# EAGLE design Module_Motor_Stepper (EAGLE 9.6.2)
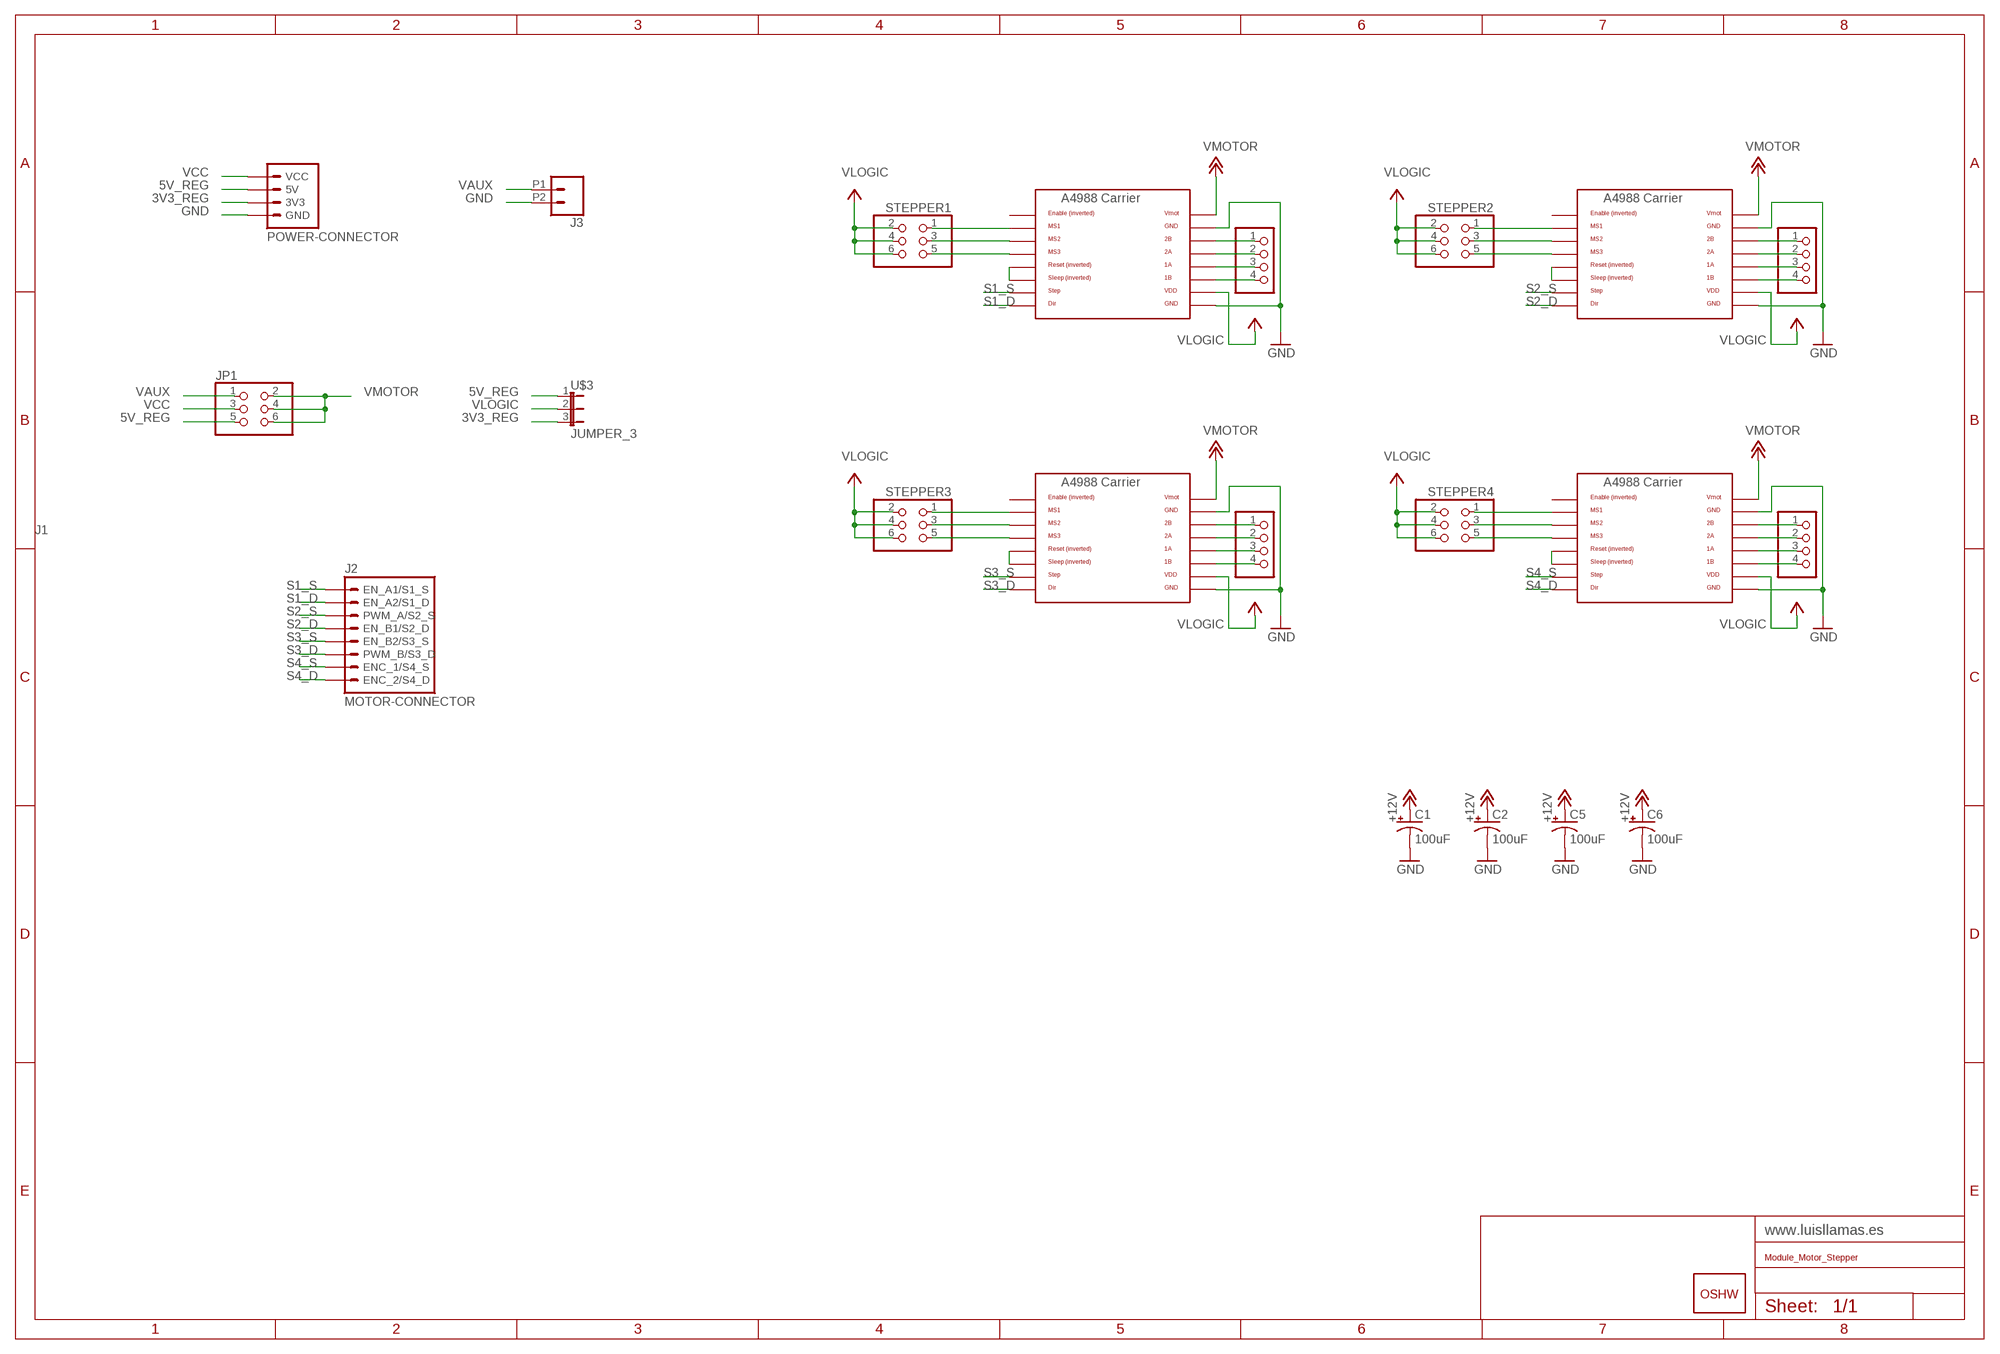
[diagram p0: schematic, sheet 1]

## Parts
C1  100uF  CPOL-US153CLV-0605  [153CLV-0605]
C2  100uF  CPOL-US153CLV-0605  [153CLV-0605]
C5  100uF  CPOL-US153CLV-0605  [153CLV-0605]
C6  100uF  CPOL-US153CLV-0605  [153CLV-0605]
E0-MOT1  PINHD-1X4  [1X04]
E0-MOT2  PINHD-1X4  [1X04]
E0-MOT4  PINHD-1X4  [1X04]
E0-MOT6  PINHD-1X4  [1X04]
GOLD_ORB_SM1  OSHWLOGO_GOLD_ORB_MED  [OSHW1]
J1  POWER-CONNECTOR  [POWER-CONNECTOR]
J2  MOTOR-CONNECTOR  [MOTOR-CONNECTOR]
J3  CONN_022.54MM_SCREWTERM  [1X02_2.54_SCREWTERM]
JP1  JUMPER_3X2/OCT  [JUMPER_3X2]
STEPPER1  PINHD-2X3  [2X03]
STEPPER2  PINHD-2X3  [2X03]
STEPPER3  PINHD-2X3  [2X03]
STEPPER4  PINHD-2X3  [2X03]
U$1  A4988BREAKOUT  [A4988BREAKOUT]
U$2  A4988BREAKOUT  [A4988BREAKOUT]
U$3  JUMPER_3  [JUMPER_3]
U$5  A4988BREAKOUT  [A4988BREAKOUT]
U$7  A4988BREAKOUT  [A4988BREAKOUT]

## Nets
3V3_REG: J1.3V3 U$3.3
5V_REG: J1.5V JP1.5 U$3.1
GND: C1.- C2.- C5.- C6.- J1.GND J3.P2 U$1.GND U$1.GND@0(GND) U$2.GND U$2.GND@0(GND) U$5.GND U$5.GND@0(GND) U$7.GND U$7.GND@0(GND)
N$1: STEPPER1.5 U$1.MS3
N$2: U$1.RST U$1.SLP(SLEEP)
N$7: STEPPER1.1 U$1.MS1
N$12: STEPPER1.3 U$1.MS2
N$13: E0-MOT1.1 U$1.2B
N$14: E0-MOT1.2 U$1.2A
N$15: E0-MOT1.3 U$1.1A
N$16: E0-MOT1.4 U$1.1B
N$17: STEPPER2.5 U$2.MS3
N$18: U$2.RST U$2.SLP(SLEEP)
N$19: STEPPER2.1 U$2.MS1
N$20: STEPPER2.3 U$2.MS2
N$21: E0-MOT2.1 U$2.2B
N$22: E0-MOT2.2 U$2.2A
N$23: E0-MOT2.3 U$2.1A
N$24: E0-MOT2.4 U$2.1B
N$33: STEPPER3.5 U$5.MS3
N$34: U$5.RST U$5.SLP(SLEEP)
N$35: STEPPER3.1 U$5.MS1
N$36: STEPPER3.3 U$5.MS2
N$37: E0-MOT4.1 U$5.2B
N$38: E0-MOT4.2 U$5.2A
N$39: E0-MOT4.3 U$5.1A
N$40: E0-MOT4.4 U$5.1B
N$49: STEPPER4.5 U$7.MS3
N$50: U$7.RST U$7.SLP(SLEEP)
N$51: STEPPER4.1 U$7.MS1
N$52: STEPPER4.3 U$7.MS2
N$53: E0-MOT6.1 U$7.2B
N$54: E0-MOT6.2 U$7.2A
N$55: E0-MOT6.3 U$7.1A
N$56: E0-MOT6.4 U$7.1B
S1_D: J2.EN_A2/S1_D U$1.DIR
S1_S: J2.EN_A1/S1_S U$1.STEP
S2_D: J2.EN_B1/S2_D U$2.DIR
S2_S: J2.PWM_A/S2_S U$2.STEP
S3_D: J2.PWM_B/S3_D U$5.DIR
S3_S: J2.EN_B2/S3_S U$5.STEP
S4_D: J2.ENC_2/S4_D U$7.DIR
S4_S: J2.ENC_1/S4_S U$7.STEP
VAUX: J3.P1 JP1.1
VCC: J1.VCC JP1.3
VLOGIC: STEPPER1.2 STEPPER1.4 STEPPER1.6 STEPPER2.2 STEPPER2.4 STEPPER2.6 STEPPER3.2 STEPPER3.4 STEPPER3.6 STEPPER4.2 STEPPER4.4 STEPPER4.6 U$1.VDD U$2.VDD U$3.2 U$5.VDD U$7.VDD ; supply symbol labelled VCC
VMOTOR: C1.+ C2.+ C5.+ C6.+ JP1.2 JP1.4 JP1.6 U$1.VMOT U$2.VMOT U$5.VMOT U$7.VMOT ; supply symbol labelled +12V
Unconnected: U$1.EN U$2.EN U$5.EN U$7.EN

## Notes on the sheet
- E0 | E0
- E0 | E0
- E0 | E1
- X | Y

## Library data of the parts
C1 C2 C5 C6 = adafruit:CPOL-US: POLARIZED CAPACITOR, American symbol
E0-MOT1 E0-MOT2 E0-MOT4 E0-MOT6 = RepRapjr:PINHD-1X4: PIN HEADER
GOLD_ORB_SM1 = LLL_Frames:OSHWLOGO: These are Open-Source Hardware logos.
J1 = LLL_Power:POWER-CONNECTOR: JST Connector
J2 = LLL_Motors:MOTOR-CONNECTOR: MOTOR CONNECTOR 8p DC Motor EN_A1 EN_A2 PWM_A EN_B1 EN_B2 PWM_B ENC_1 ENC_2 Stepper STEP1_S STEP1_D STEP2_S STEP2_D STEP3_S STEP3_D STEP4_S STEP4_D
J3 = LLL_Connectors:CONN_02: Multi connection point. Often used as Generic Header-pin footprint for 0.1 inch spaced/style header connections On any of the 0.1 inch spaced packages, you can populate with these: Break Away Headers - Straight <https://www.sparkfun.com/products/116> (PRT-00116) Break Away Male Headers - Right Angle <https://www.sparkfun.com/products/553> (PRT-00553) Female Headers <https://www.sparkfun.com/products/115> (PRT-00115) Break Away Headers - Machine Pin <https://www.sparkfun.com/products/117> (PRT-00117) Break Away Female Headers - Swiss Machine Pin <https://www.sparkfun.com/products/743> (PRT-00743) For SCREWTERMINALS and SPRING TERMINALS visit here: Screw Terimnals on SparkFun.com <https://www.sparkfun.com/search/results?term=Screw+Terminals> (5mm/3.5mm/2.54mm spacing) This device is also useful as a general connection point to wire up your design to another part of your project. Our various solder wires solder well into these plated through hole pads. Hook-Up Wire - Assortment (Stranded, 22 AWG) <https://www.sparkfun.com/products/11375> (PRT-11375) Hook-Up Wire - Assortment (Solid Core, 22 AWG) <https://www.sparkfun.com/products/11367> (PRT-11367) View the entire wire category on our website here <https://www.sparkfun.com/categories/141> Special notes: Molex polarized connector foot print use with: PRT-08233 with associated crimp pins and housings. 2.54_SCREWTERM for use with PRT-10571. 3.5mm Screw Terminal footprints for PRT-08084 5mm Screw Terminal footprints for use with PRT-08432
JP1 = LLL_Jumpers:JUMPER_3X2: Header ISR
STEPPER1-STEPPER4 = pinhead:PINHD-2X3: PIN HEADER
U$1 U$2 U$5 U$7 = RepRapjr:A4988BREAKOUT
U$3 = LLL_Jumpers:JUMPER_3

## Net classes
0 default: clearance 0.205 mm

## Board
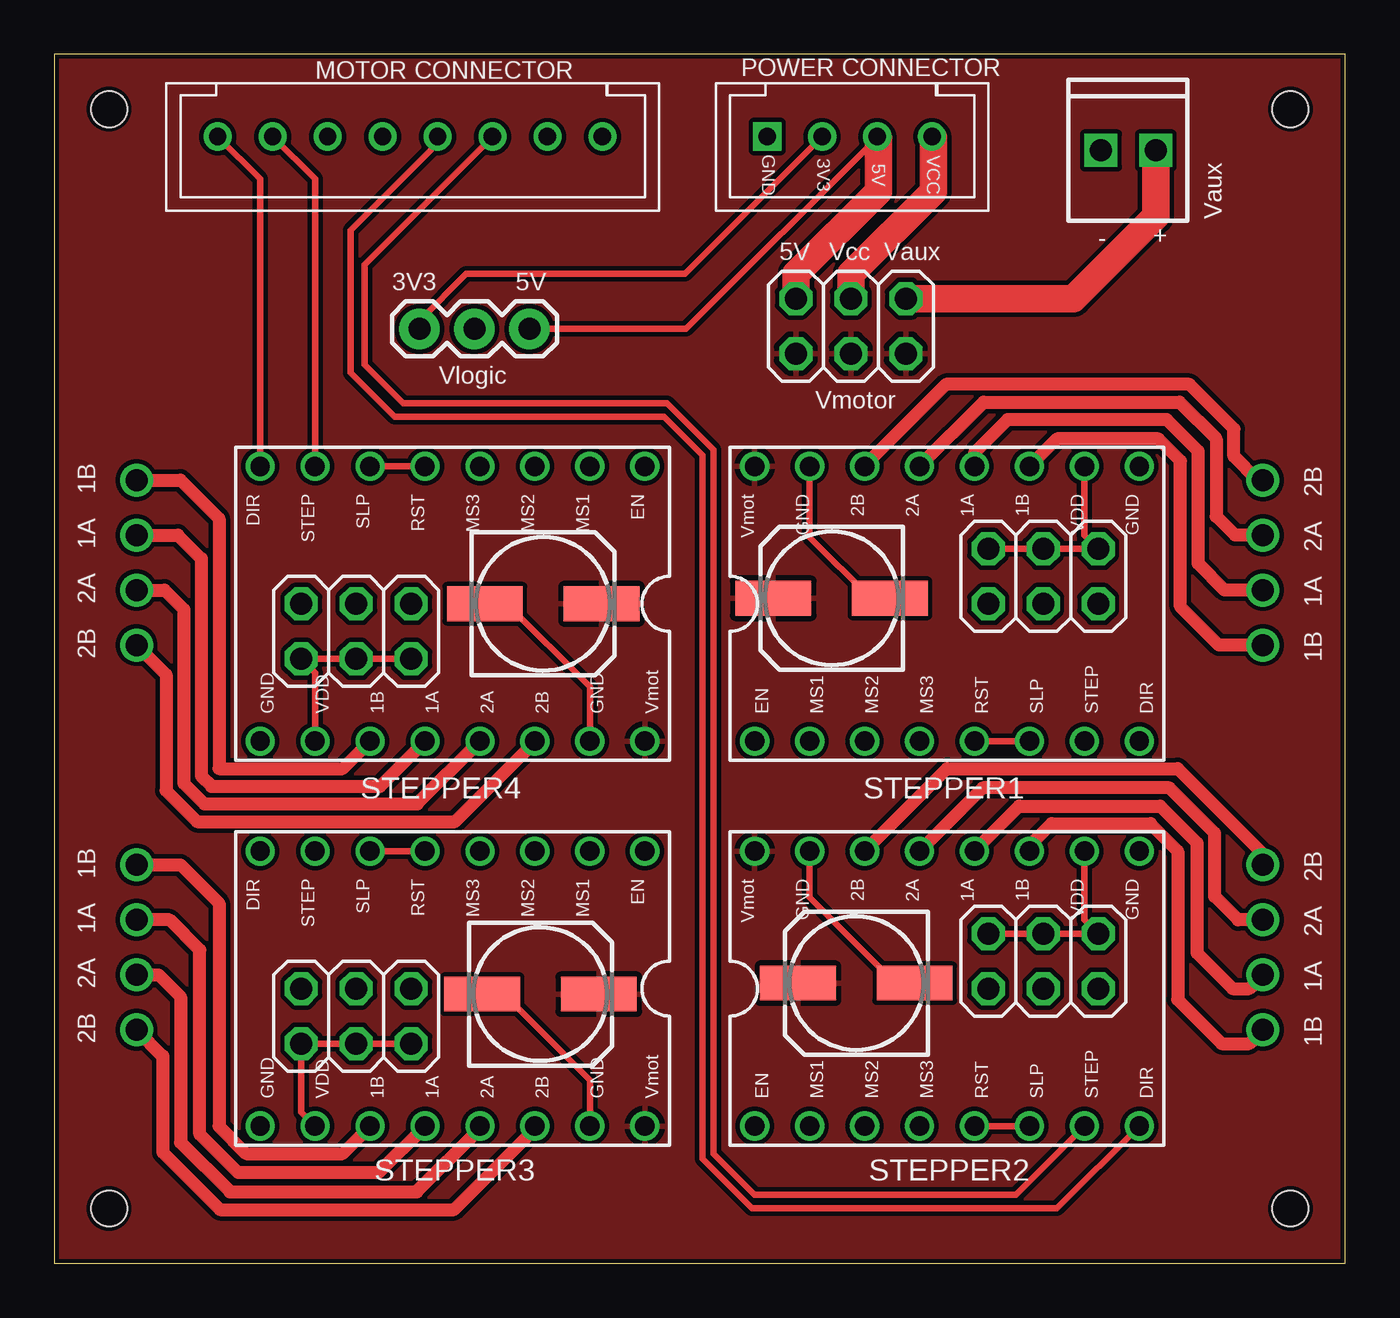
[diagram p1: board, top side]
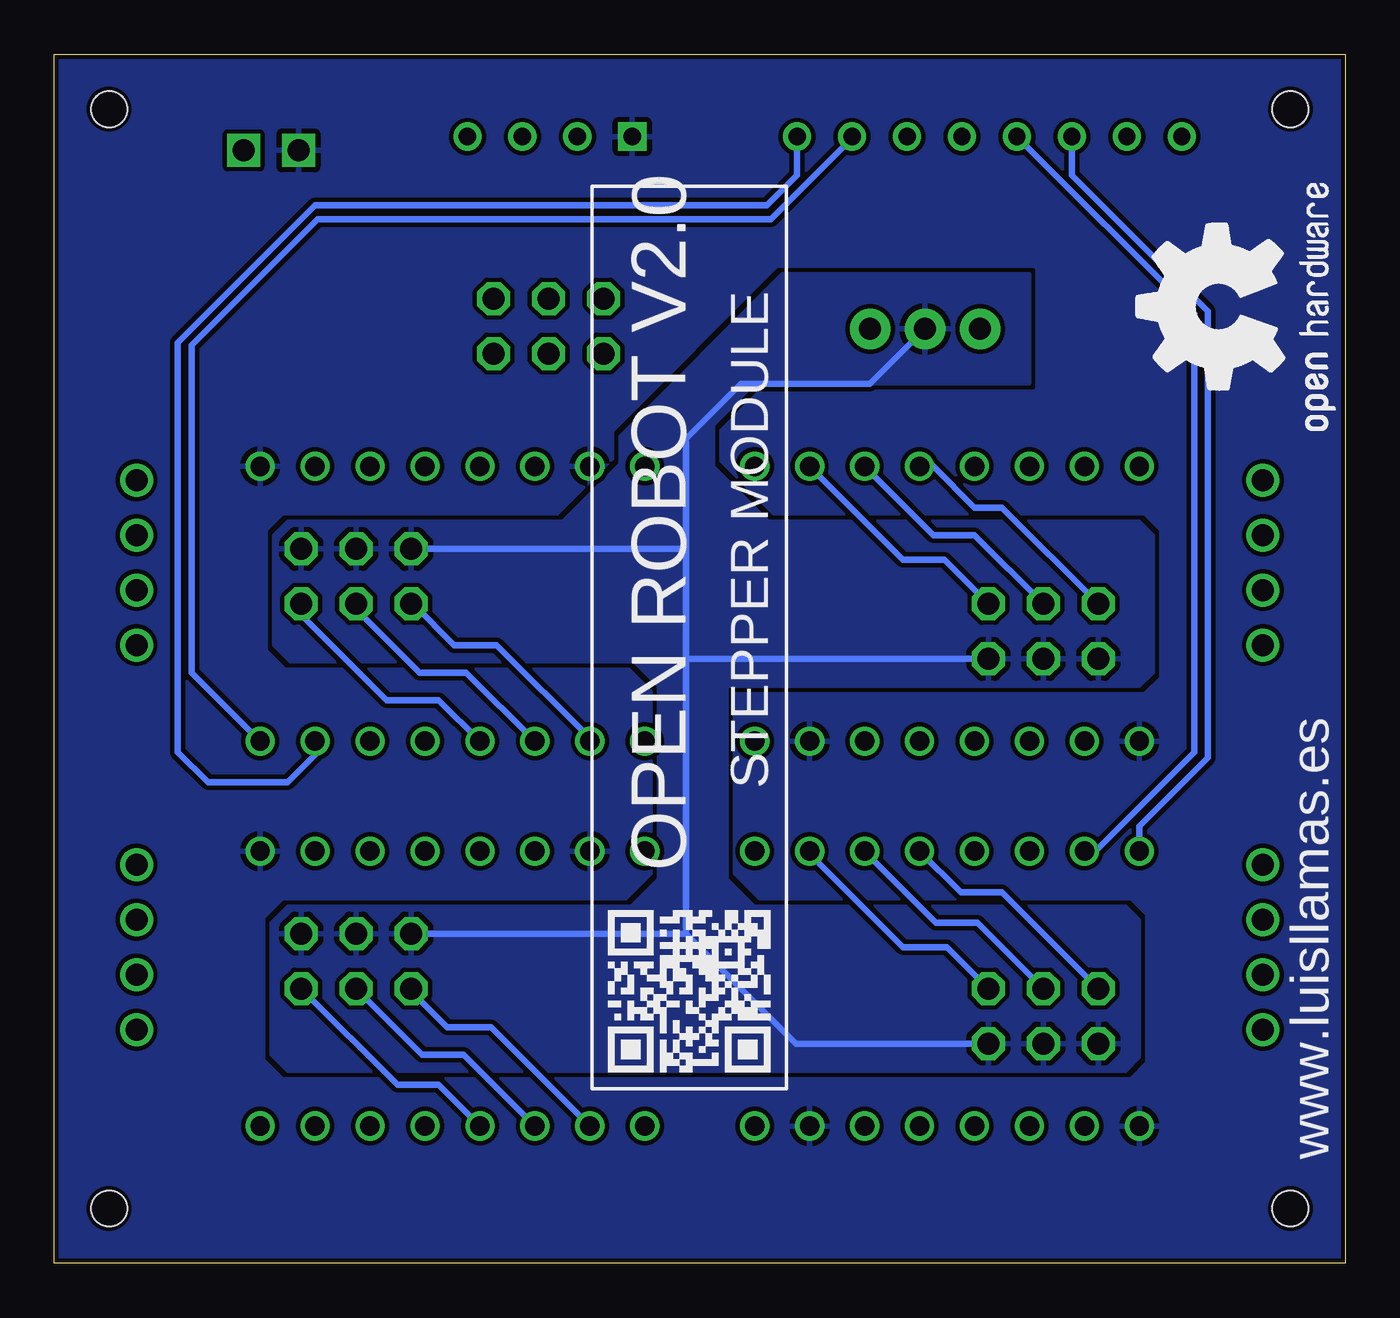
[diagram p2: board, bottom side, seen from below]

Size 59.69 x 55.88 mm. Coordinates in mm from the lower left corner, seen from the top.
Outline: 0,55.88 0,0 59.69,0 59.69,55.88 0,55.88
Copper layers (1*16): Top 0.035559375mm / dielectric 1.6mm / Bottom 0.035559375mm
Design rules "jlcpcb2layer": minimum track width 5mil, minimum drill 12mil, track to track 5mil, track to pad 5mil, pad to pad 5mil, via to via 5mil, smd to smd 5mil, copper to edge 8mil, drill to drill 6mil, minimum pad ring 5mil, minimum via ring 3mil, stop-mask expansion 2.5mil, vias tented up to drill 0mil, thermal gap 10mil
Holes 1.65 mm at 2.54,53.34 2.54,2.54 57.15,53.34 57.15,2.54

### Footprints (pad centres in the part's own frame; a part is rotated, then mirrored left to right if it is on the bottom)
153CLV-0605 = smd 3.5 x 1.6: + 2.7,0; - -2.7,0
1X04 = drill 1.016: 1 -2.54,0; 2 0,0; 3 2.54,0; 4 5.08,0
POWER-CONNECTOR = drill 0.8 pad 1.3: 3V3 0,1.326; 5V 0,-1.214; VCC 0,-3.754 | drill 0.8 pad 1.3 square: GND 0,3.866
MOTOR-CONNECTOR = drill 0.8 pad 1.3: EN_A1/S1_S 0,-8.834; EN_A2/S1_D 0,-6.294; EN_B1/S2_D 0,-1.214; EN_B2/S3_S 0,1.326; ENC_1/S4_S 0,6.406; ENC_2/S4_D 0,8.946; PWM_A/S2_S 0,-3.754; PWM_B/S3_D 0,3.866
1X02_2.54_SCREWTERM = drill 1.016 square: P1 2.54,0; P2 0,0
JUMPER_3X2 = drill 1.016 octagon: 1 -2.54,-1.27; 2 -2.54,1.27; 3 0,-1.27; 4 0,1.27; 5 2.54,-1.27; 6 2.54,1.27
2X03 = drill 1.016 octagon: 1 -2.54,-1.27; 2 -2.54,1.27; 3 0,-1.27; 4 0,1.27; 5 2.54,-1.27; 6 2.54,1.27
A4988BREAKOUT = drill 0.9: 1A 8.89,1.27; 1B 11.43,1.27; 2A 6.35,1.27; 2B 3.81,1.27; DIR 16.51,-11.43; EN -1.27,-11.43; GND 16.51,1.27; GND@0 1.27,1.27; MS1 1.27,-11.43; MS2 3.81,-11.43; MS3 6.35,-11.43; RST 8.89,-11.43; SLP 11.43,-11.43; STEP 13.97,-11.43; VDD 13.97,1.27; VMOT -1.27,1.27
JUMPER_3 = drill 1.016 pad 1.88: 1 0,0; 2 2.54,0; 3 5.08,0

### Placement (x,y rotation side)
C1  35.94,30.73 180 top
C2  22.48,12.45 0 top
C5  37.08,12.95 180 top
C6  22.61,30.48 0 top
E0-MOT1  55.88,33.66 270 top
E0-MOT2  55.88,15.88 270 top
E0-MOT4  3.81,13.33 90 top
E0-MOT6  3.81,31.11 90 top
GOLD_ORB_SM1  -1.27,37.85 90 bottom
J1  36.83,52.07 90 top
J2  16.51,52.07 90 top
J3  48.39,51.44 0 top
JP1  36.83,43.31 180 top
STEPPER1  45.72,31.75 0 top
STEPPER2  45.72,13.97 0 top
STEPPER3  13.97,11.43 180 top
STEPPER4  13.97,29.21 180 top
U$1  33.66,35.56 0 top
U$2  33.66,17.78 0 top
U$3  21.97,43.18 180 top
U$5  26.04,7.62 180 top
U$7  26.04,25.4 180 top

### Tracks (layer width: path | path; a pad name or v marks a point on that pad's centre or on a via)
3V3_REG
  Top 0.305: J1.3V3 29.15,45.72 19.05,45.72 16.89,43.56 U$3.3
5V_REG
  Top 0.305: J1.5V 38.07,52.04 | U$3.1 29.21,43.18 38.07,52.04 | 38.1,52.01 38.07,52.04
  Top 1.27: JP1.5 34.29,45.72 38.1,49.53 38.1,52.01
GND
  Top 0.305: C2.- 20.8,12.45 24.77,8.48 U$5.GND@0 | C5.- 38.9,12.95 34.92,16.92 U$2.GND@0 | C1.- 37.75,30.73 34.92,33.56 U$1.GND@0 | C6.- 20.92,30.48 24.77,26.64 U$7.GND@0
  pour Bottom (rank 2): 0,0 0,55.88 59.69,55.88 59.69,0
N$1
  Bottom 0.305: U$1.MS3 41.91,26.04 44.32,26.04 48.26,29.97 STEPPER1.5
N$2
  Top 0.305: U$1.SLP U$1.RST
N$7
  Bottom 0.305: STEPPER1.1 43.09,30.48 41.19,28.57 39.24,28.57 34.92,24.26 U$1.MS1
N$12
  Bottom 0.305: U$1.MS2 40.64,27.3 42.8,27.3 45.72,30.23 STEPPER1.3
N$13
  Top 0.61: E0-MOT1.1 55.63,36.2 54.53,37.29 54.53,38.57 52.48,40.62 41.23,40.62 37.47,36.85 U$1.2B
N$14
  Top 0.61: U$1.2A 42.98,39.8 52.02,39.8 53.72,38.1 53.72,34.52 54.59,33.66 E0-MOT1.2
N$15
  Top 0.61: E0-MOT1.3 54.1,31.11 52.88,32.33 52.88,37.54 51.44,38.99 44.07,38.99 42.55,37.47 U$1.1A
N$16
  Top 0.61: E0-MOT1.4 53.85,28.57 52.07,30.35 52.07,37.08 51.05,38.1 46.35,38.1 U$1.1B
N$17
  Bottom 0.305: U$2.MS3 41.91,8.26 43.81,8.26 STEPPER2.5
N$18
  Top 0.305: U$2.SLP U$2.RST
N$19
  Bottom 0.305: U$2.MS1 39.5,10.92 41.53,10.92 43.18,12.57 STEPPER2.1
N$20
  Bottom 0.305: U$2.MS2 40.77,9.65 42.67,9.65 STEPPER2.3
N$21
  Top 0.61: U$2.2B 41.27,22.86 51.94,22.86 55.88,18.92 E0-MOT2.1
N$22
  Top 0.61: E0-MOT2.2 54.74,15.88 53.65,16.96 53.65,19.89 51.56,21.97 42.93,21.97 U$2.2A
N$23
  Top 0.61: U$2.1A 42.55,19.07 44.6,21.14 51.13,21.14 52.83,19.43 52.83,14.35 54.48,12.7 55.24,12.7 E0-MOT2.3
N$24
  Top 0.61: U$2.1B 45.09,19.3 46.1,20.32 50.67,20.32 51.94,19.05 51.94,12.19 53.98,10.16 55.24,10.16 E0-MOT2.4
N$33
  Bottom 0.305: STEPPER3.5 15.88,17.14 17.78,17.14 U$5.MS3
N$34
  Top 0.305: U$5.SLP U$5.RST
N$35
  Bottom 0.305: STEPPER3.1 18.41,14.6 20.45,14.6 24.77,18.92 U$5.MS1
N$36
  Bottom 0.305: U$5.MS2 18.92,15.75 17.02,15.75 STEPPER3.3
N$37
  Top 0.61: E0-MOT4.1 5.03,9.58 5.03,5.13 7.67,2.49 18.49,2.49 22.23,6.22 U$5.2B
N$38
  Top 0.61: E0-MOT4.2 4.83,13.34 5.84,12.32 5.84,5.59 8.13,3.3 16.76,3.3 19.68,6.22 U$5.2A
N$39
  Top 0.61: U$5.1A 14.99,4.19 8.51,4.19 6.73,5.97 6.73,14.48 5.33,15.88 E0-MOT4.3 | E0-MOT4.3
N$40
  Top 0.61: E0-MOT4.4 5.84,18.41 7.62,16.64 7.62,6.35 8.89,5.08 13.34,5.08 U$5.1B
N$49
  Bottom 0.305: U$7.MS3 19.05,36.83 17.14,34.92 15.88,34.92 STEPPER4.5
N$50
  Top 0.305: U$7.RST U$7.SLP
N$51
  Bottom 0.305: STEPPER4.1 18.54,32.51 20.45,32.51 U$7.MS1
N$52
  Bottom 0.305: U$7.MS2 19.05,33.66 17.14,33.66 STEPPER4.3
N$53
  Top 0.61: E0-MOT6.1 5.18,27.21 5.18,21.85 6.61,20.42 18.54,20.42 22.23,24.11 U$7.2B | E0-MOT6.1
N$54
  Top 0.61: E0-MOT6.2 5.1,31.11 5.99,30.23 5.99,22.18 6.95,21.23 16.79,21.23 U$7.2A
N$55
  Top 0.61: E0-MOT6.3 5.71,33.66 6.8,32.56 6.8,22.52 7.28,22.05 15.06,22.05 U$7.1A
N$56
  Top 0.61: E0-MOT6.4 5.84,36.2 7.62,34.42 7.62,22.86 13.34,22.86 U$7.1B
S1_D
  Bottom 0.305: J2.EN_A2/S1_D 22.8,52 26.54,48.26 47.5,48.26 53.34,42.42 53.34,27.3 U$1.DIR
S1_S
  Bottom 0.305: J2.EN_A1/S1_S 25.34,50.29 26.74,48.9 47.62,48.9 53.98,42.55 53.98,23.62 52.58,22.23 48.9,22.23 47.62,23.5 U$1.STEP
S2_D
  Top 0.305: J2.EN_B1/S2_D 17.72,51.76 13.72,47.75 13.72,41.15 15.75,39.12 28.19,39.12 29.97,37.34 29.97,4.83 32.26,2.54 46.35,2.54 U$2.DIR
S2_S
  Top 0.305: J2.PWM_A/S2_S 14.35,46.16 14.35,41.53 16.13,39.75 28.32,39.75 30.48,37.59 30.48,5.08 32.38,3.17 44.45,3.17 U$2.STEP
S3_D
  Bottom 0.305: U$5.DIR 9.53,20.19 6.35,23.37 6.35,44 12.64,50.29 J2.PWM_B/S3_D
S3_S
  Bottom 0.305: J2.EN_B2/S3_S 6.99,43.87 6.99,23.62 11.56,19.05 U$5.STEP
S4_D
  Top 0.305: J2.ENC_2/S4_D 9.53,50.11 U$7.DIR
S4_S
  Top 0.305: J2.ENC_1/S4_S 12.06,50.11 U$7.STEP
VAUX
  Top 1.27: J3.P1 50.93,48.39 47.12,44.58 JP1.1
VCC
  Top 0.305: J1.VCC 40.64,52.01
  Top 1.27: JP1.3 36.83,45.72 40.64,49.53 40.64,52.01
VLOGIC
  Top 0.305: STEPPER2.2 STEPPER2.4 STEPPER2.6 47.62,15.88 U$2.VDD | STEPPER1.2 STEPPER1.4 STEPPER1.6 47.62,33.66 U$1.VDD | STEPPER4.2 STEPPER4.4 STEPPER4.6 12.06,27.3 U$7.VDD | STEPPER3.2 STEPPER3.4 STEPPER3.6 11.43,6.99 U$5.VDD
  Bottom 0.305: U$3.2 21.97,40.64 27.94,40.64 30.48,38.1 30.48,33.02 | 30.48,33.02 STEPPER1.2 | STEPPER4.2 30.48,27.94 | 30.48,27.94 30.48,33.02 | 30.48,27.94 30.48,15.24 | STEPPER2.2 30.48,15.24 | 30.48,15.24 25.4,10.16 STEPPER3.2
  pour Bottom: 14.61,45.72 26.04,45.72 33.53,38.23 33.53,36.96 36.2,34.29 48.9,34.29 49.53,33.66 49.53,28.57 48.77,27.81 32.89,27.81 31.75,26.67 31.75,17.78 33.02,16.51 48.9,16.51 49.66,15.75 49.66,9.65 48.9,8.89 10.16,8.89 9.53,9.53 9.53,15.88 10.16,16.51 27.3,16.51 28.57,17.78 28.57,26.67 9.53,26.67 8.89,27.3 8.89,33.66 9.53,34.29 26.67,34.29 29.21,36.83 29.21,38.73 27.3,40.64 14.61,40.64
VMOTOR
  pour Top (rank 2): 0,0 0,55.88 59.69,55.88 59.69,0

### Text on the board
tPlace: MOTOR CONNECTOR | POWER CONNECTOR | Vaux | - | + | 5V | Vcc | Vaux | 3V3 | 5V | Vlogic | Vmotor | 2B | 1B | 2A | 1A | 1A | 2A | 1B | 2B | STEPPER4 | STEPPER1 | 2B | 1B | 2A | 1A | 1A | 2A | 1B | 2B | STEPPER3 | STEPPER2
bPlace: STEPPER MODULE | OPEN ROBOT V2.0 | www.luisllamas.es
_tsilk: + | I2C | END STOPS | 21 | + | E0 | 1 | S | 20 | D10 | 1 | - | - | E1 | + | + | + | D9 | T0 | T1 | T2 | + | 1 | + | D8 | 1 | 1 | 1 | U | X | Y | Z | + | + | - | 1 | + | PS | AUX-4 | AUX-1 | AUX-2 | AUX-3 | + | - | s | s | 1 | - | + | UltiMachine | GPL3 | 1 | SERVOS | 1 | reprap.org/wiki/RAMPS | V1.4 | -